# Altium schematic sheet KISS TNC.SchDoc
size A
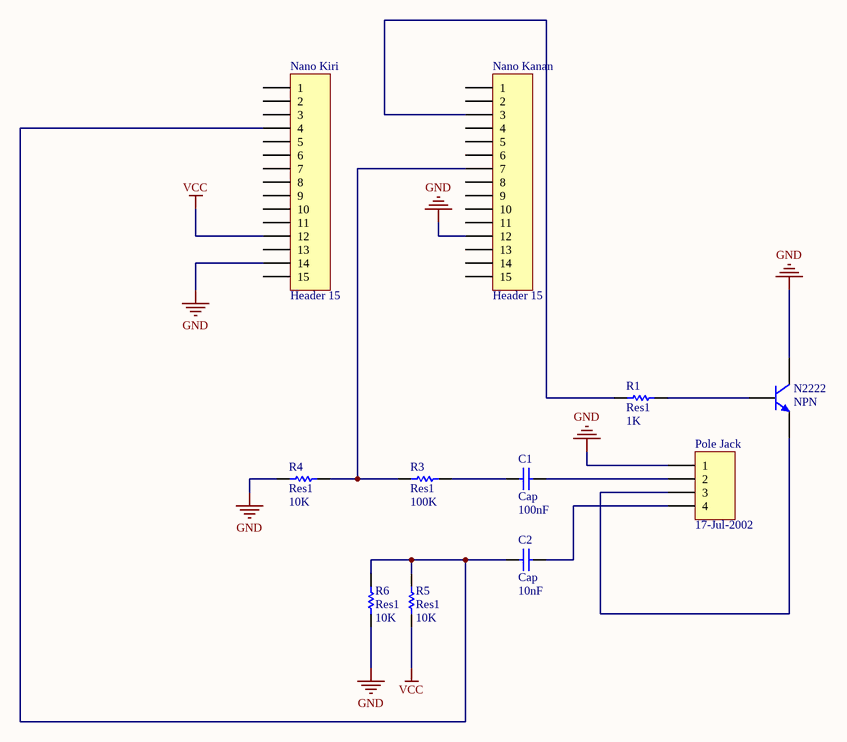
[diagram p0: KISS TNC.SchDoc]

## Parts
C1  Cap  value 100nF  [RAD-0.3]
C2  Cap  value 10nF  [RAD-0.3]
N2222  NPN  [TO-226-AA]
Nano_Kanan  Header 15  [HDR1X15]
Nano_Kiri  Header 15  [HDR1X15]
Pole_Jack  17-Jul-2002  [HDR1X4H]
R1  Res1  value 1K  [AXIAL-0.3]
R3  Res1  value 100K  [AXIAL-0.3]
R4  Res1  value 10K  [AXIAL-0.3]
R5  Res1  value 10K  [AXIAL-0.3]
R6  Res1  value 10K  [AXIAL-0.3]

## Nets
GND: N2222.1(C) Nano_Kanan.12 Nano_Kiri.14 Pole_Jack.1 R4.1 R6.1
VCC: Nano_Kiri.12 R5.1
NetC1_1: C1.1 R3.2
NetC1_2: C1.2 Pole_Jack.2
NetC2_1: C2.1 Nano_Kiri.4 R5.2 R6.2
NetC2_2: C2.2 Pole_Jack.4
NetN2222_2: N2222.2(B) R1.2
NetN2222_3: N2222.3(E) Pole_Jack.3
NetNano_Kanan_3: Nano_Kanan.3 R1.1
NetNano_Kanan_7: Nano_Kanan.7 R3.1 R4.2

Not connected (* = marked no-connect by the designer): Nano_Kanan 1 2 4 5 6 8 9 10 11 13 14 15; Nano_Kiri 1 2 3 5 6 7 8 9 10 11 13 15

## Library data of the parts
C1 C2 = Cap: Capacitor; Published: 8-Jun-2000; LatestRevisionDate: 17-Jul-2002; LatestRevisionNote: Re-released for DXP Platform.; PackageReference: RAD-0.3; Publisher: Altium Limited; PackageDescription: Radial Cap, Thru-Hole; 2 Leads; 0.3 in Pin Spacing
N2222 = NPN: NPN Bipolar Transistor; Published: 8-Jun-2000; LatestRevisionDate: 17-Jul-2002; LatestRevisionNote: Re-released for DXP Platform.; PackageReference: TO-226-AA; Publisher: Altium Limited; PackageDescription: TO, Flat Index; 3 In-Line, Axial Leads; Body Dia. 4.8mm; Leads 0.55 x 0.51 mm (max); Code_JEDEC: TO-226-AA
Nano_Kanan Nano_Kiri = Header 15: Header, 15-Pin; LatestRevisionDate: 17-Jul-2002; LatestRevisionNote: Re-released for DXP Platform.; Publisher: Altium Limited
Pole_Jack = Header 4H: Header, 4-Pin, Right Angle; pin to pad: 1>Sleeve 2>Ring1 3>Ring2 4>Tip; LatestRevisionDate: 17-Jul-2002; LatestRevisionNote: Re-released for DXP Platform.; Publisher: Altium Limited
R1 R3-R6 = Res1: Resistor; Published: 8-Jun-2000; LatestRevisionDate: 17-Jul-2002; LatestRevisionNote: Re-released for DXP Platform.; PackageReference: AXIAL-0.3; Publisher: Altium Limited; PackageDescription: Axial Device, Thru-Hole; 2 Leads; 0.3 in Pin Spacing